# EAGLE design PMS (EAGLE 7.5.0)
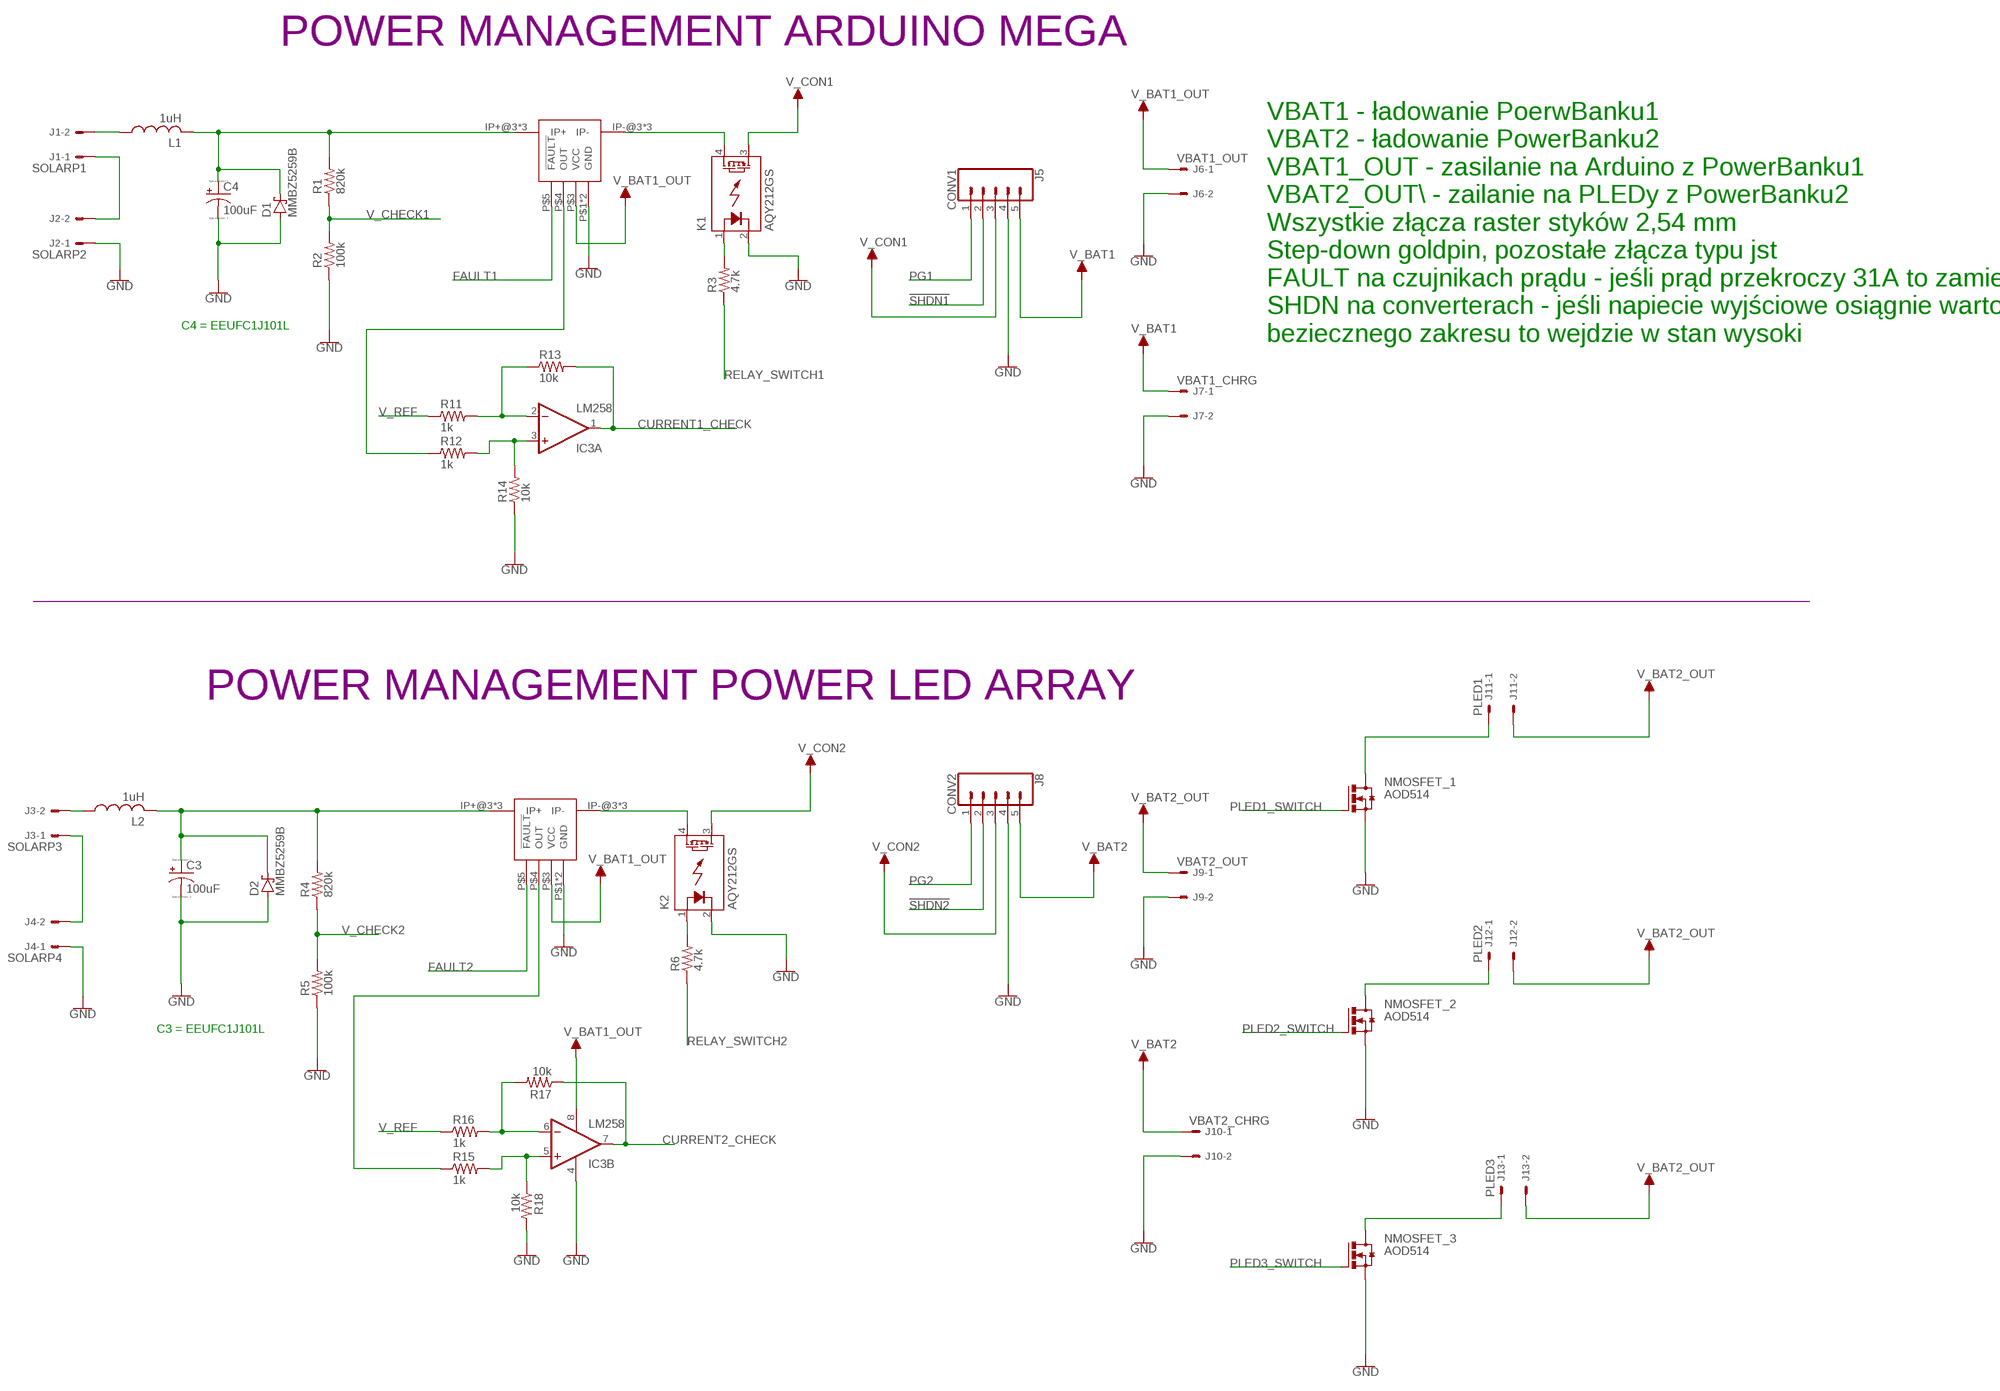
[diagram p0: schematic, sheet 1, part 1 of 2]
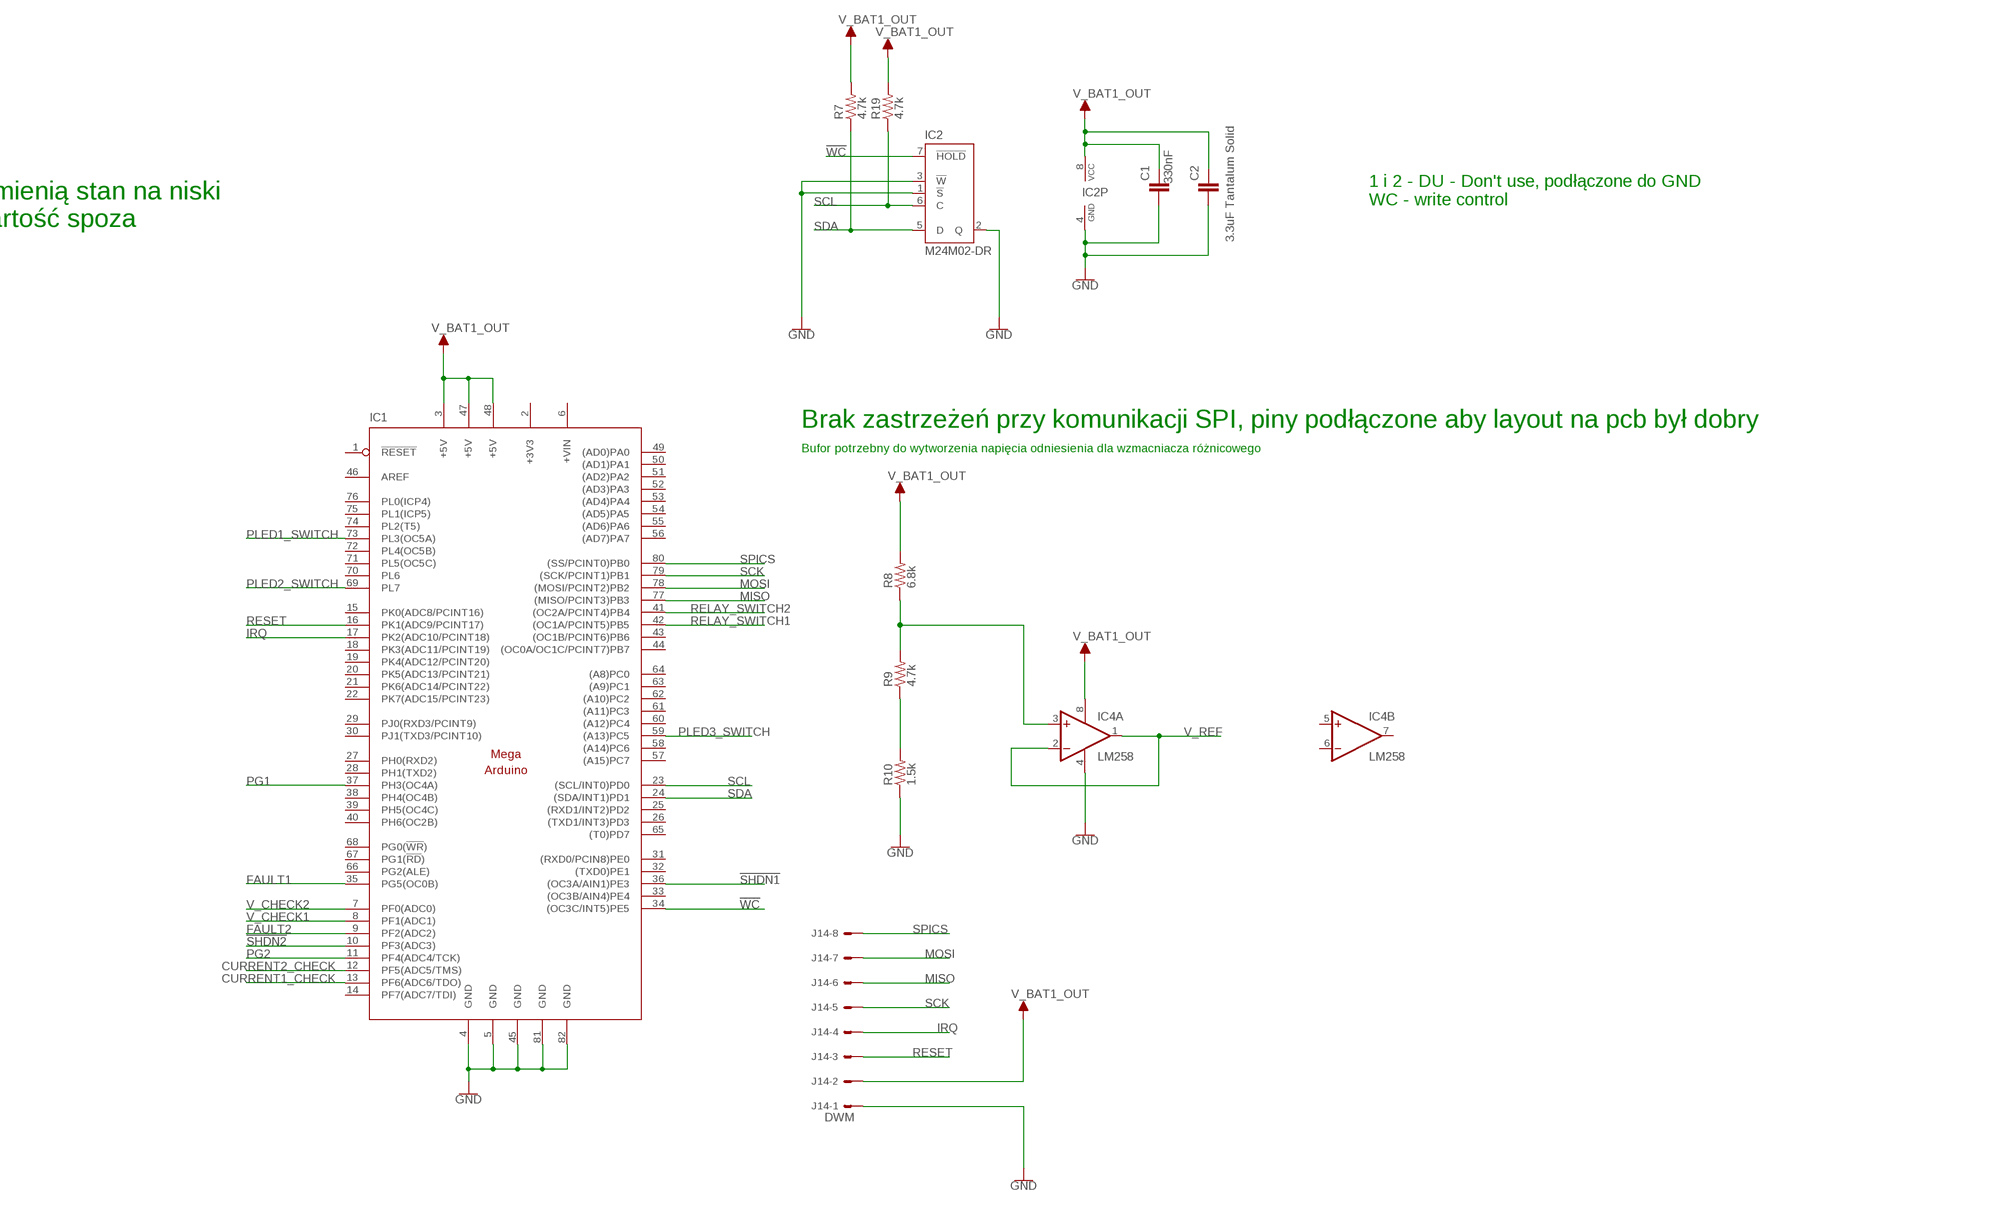
[diagram p1: schematic, sheet 1, part 2 of 2]

## Parts
C1  330nF  C-EUC0805  [C0805]
C2  3.3uF Tantalum Solid  C-EUC1206  [C1206]
C3  100uF  CPOL-USE3.5-8  [E3,5-8]
C4  100uF  CPOL-USE3.5-8  [E3,5-8]
CURRETN_SENS  ACS711EXSH  [POLOLU2453_SMALL_HOLES]
D1  MMBZ5259B  BAS40  [SOT23]
D2  MMBZ5259B  BAS40  [SOT23]
IC1  MEGAARDUINO_13  [MEGA_ARDUINO_3]
IC2  M24M02-DR  ST95P08M  [SO08]
IC3  LM258  LM358D  [SO08]
IC4  LM258  LM358D  [SO08]
J1  SOLARP1  22-27-2021-02  [6410-02]
J2  SOLARP2  22-27-2021-02  [6410-02]
J3  SOLARP3  22-27-2021-02  [6410-02]
J4  SOLARP4  22-27-2021-02  [6410-02]
J5  CONV1  CONN_05  [1X05]
J6  VBAT1_OUT  22-27-2021-02  [6410-02]
J7  VBAT1_CHRG  22-27-2021-02  [6410-02]
J8  CONV2  CONN_05  [1X05]
J9  VBAT2_OUT  22-27-2021-02  [6410-02]
J10  VBAT2_CHRG  22-27-2021-02  [6410-02]
J11  PLED1  22-27-2021-02  [6410-02]
J12  PLED2  22-27-2021-02  [6410-02]
J13  PLED3  22-27-2021-02  [6410-02]
J14  DWM  22-27-2081-08  [6410-08]
K1  AQY212GS  AQY21SOP  [SOP04]
K2  AQY212GS  AQY21SOP  [SOP04]
L1  1uH  L-USL3225M  [L3225M]
L2  1uH  L-USL3225M  [L3225M]
NMOSFET_1  AOD514  N_MOSFET_TO252  [TO252]
NMOSFET_2  AOD514  N_MOSFET_TO252  [TO252]
NMOSFET_3  AOD514  N_MOSFET_TO252  [TO252]
R1  820k  R-US_R0805  [R0805]
R2  100k  R-US_R0805  [R0805]
R3  4.7k  R-US_R0805  [R0805]
R4  820k  R-US_R0805  [R0805]
R5  100k  R-US_R0805  [R0805]
R6  4.7k  R-US_R0805  [R0805]
R7  4.7k  R-US_R0805  [R0805]
R8  6.8k  R-US_R0805  [R0805]
R9  4.7k  R-US_R0805  [R0805]
R10  1.5k  R-US_R0805  [R0805]
R11  1k  R-US_R0805  [R0805]
R12  1k  R-US_R0805  [R0805]
R13  10k  R-US_R0805  [R0805]
R14  10k  R-US_R0805  [R0805]
R15  1k  R-US_R0805  [R0805]
R16  1k  R-US_R0805  [R0805]
R17  10k  R-US_R0805  [R0805]
R18  10k  R-US_R0805  [R0805]
R19  4.7k  R-US_R0805  [R0805]
U$2  ACS711EXSH  [POLOLU2453_SMALL_HOLES]

## Nets
!SHDN1: IC1.36((OC3A/AIN1)PE3) J5.2
!SHDN2: IC1.10(PF3(ADC3)) J8.2
!WC: IC1.34((OC3C/INT5)PE5) IC2.7(!HOLD)
CURRENT1_CHECK: IC1.13(PF6(ADC6/TDO)) IC3.1(A:OUT) R13.2
CURRENT2_CHECK: IC1.12(PF5(ADC5/TMS)) IC3.7(B:OUT) R17.1
FAULT1: CURRETN_SENS.P$5(!FAULT) IC1.35(PG5(OC0B))
FAULT2: IC1.9(PF2(ADC2)) U$2.P$5(!FAULT)
GND: C1.1 C2.1 C3.- C4.- CURRETN_SENS.P$1(GND) CURRETN_SENS.P$2(GND) D1.1(A) D2.1(A) IC1.4(GND) IC1.5(GND) IC1.45(GND) IC1.81(GND) IC1.82(GND) IC2.1(!S) IC2.2(Q) IC2.3(!W) IC2.4(GND) IC3.4(P:V-) IC4.4(P:V-) J2.1 J4.1 J5.4 J6.2 J7.2 J8.4 J9.2 J10.2 J14.1 K1.2(K) K2.2(K) NMOSFET_1.3(S) NMOSFET_2.3(S) NMOSFET_3.3(S) R2.1 R5.1 R10.1 R14.1 R18.2 U$2.P$1(GND) U$2.P$2(GND)
IRQ: IC1.17(PK2(ADC10/PCINT18)) J14.4
MISO: IC1.77((MISO/PCINT3)PB3) J14.6
MOSI: IC1.78((MOSI/PCINT2)PB2) J14.7
N$1: K1.1(A) R3.2
N$3: CURRETN_SENS.IP-@3(IP-) CURRETN_SENS.IP-@4(IP-) CURRETN_SENS.IP-@5(IP-) K1.4(DS1)
N$4: J3.1 J4.2
N$5: J12.1 NMOSFET_2.4(D)
N$6: K2.1(A) R6.2
N$7: J13.1 NMOSFET_3.4(D)
N$8: IC3.2(A:-IN) R11.2 R13.1
N$9: J11.1 NMOSFET_1.4(D)
N$10: J1.1 J2.2
N$11: K2.4(DS1) U$2.IP-@3(IP-) U$2.IP-@4(IP-) U$2.IP-@5(IP-)
N$12: IC4.3(A:+IN) R8.1 R9.2
N$13: CURRETN_SENS.P$4(OUT) R12.1
N$14: IC3.6(B:-IN) R16.2 R17.2
N$15: IC3.5(B:+IN) R15.2 R18.1
N$16: IC3.3(A:+IN) R12.2 R14.2
N$17: R15.1 U$2.P$4(OUT)
N$18: R9.1 R10.2
N$19: C3.+ D2.3(C) L2.2 R4.2 U$2.IP+@3(IP+) U$2.IP+@4(IP+) U$2.IP+@5(IP+)
N$20: C4.+ CURRETN_SENS.IP+@3(IP+) CURRETN_SENS.IP+@4(IP+) CURRETN_SENS.IP+@5(IP+) D1.3(C) L1.2 R1.2
N$22: J1.2 L1.1
N$23: J3.2 L2.1
PG1: IC1.37(PH3(OC4A)) J5.1
PG2: IC1.11(PF4(ADC4/TCK)) J8.1
PLED1_SWITCH: IC1.73(PL3(OC5A)) NMOSFET_1.1(G)
PLED2_SWITCH: IC1.69(PL7) NMOSFET_2.1(G)
PLED3_SWITCH: IC1.59((A13)PC5) NMOSFET_3.1(G)
RELAY_SWITCH1: IC1.42((OC1A/PCINT5)PB5) R3.1
RELAY_SWITCH2: IC1.41((OC2A/PCINT4)PB4) R6.1
RESET: IC1.16(PK1(ADC9/PCINT17)) J14.3
SCK: IC1.79((SCK/PCINT1)PB1) J14.5
SCL: IC1.23((SCL/INT0)PD0) IC2.6(C) R19.1
SDA: IC1.24((SDA/INT1)PD1) IC2.5(D) R7.1
SPICS: IC1.80((SS/PCINT0)PB0) J14.8
V2: J5.3 K1.3(DS2) ; supply symbol labelled V_CON1
V4: J8.3 K2.3(DS2) ; supply symbol labelled V_CON2
V_BAT1: J5.5 J7.1
V_BAT1_OUT: C1.2 C2.2 CURRETN_SENS.P$3(VCC) IC1.3(+5V) IC1.47(+5V) IC1.48(+5V) IC2.8(VCC) IC3.8(P:V+) IC4.8(P:V+) J6.1 J14.2 R7.2 R8.2 R19.2 U$2.P$3(VCC)
V_BAT2: J8.5 J10.1
V_BAT4: J9.1 J11.2 J12.2 J13.2 ; supply symbol labelled V_BAT2_OUT
V_CHECK1: IC1.8(PF1(ADC1)) R1.1 R2.2
V_CHECK2: IC1.7(PF0(ADC0)) R4.1 R5.2
V_REF: IC4.1(A:OUT) IC4.2(A:-IN) R11.1 R16.1
Unconnected: IC1.1(!RESET) IC1.14(PF7(ADC7/TDI)) IC1.15(PK0(ADC8/PCINT16)) IC1.18(PK3(ADC11/PCINT19)) IC1.19(PK4(ADC12/PCINT20)) IC1.20(PK5(ADC13/PCINT21)) IC1.21(PK6(ADC14/PCINT22)) IC1.22(PK7(ADC15/PCINT23)) IC1.25((RXD1/INT2)PD2) IC1.26((TXD1/INT3)PD3) IC1.27(PH0(RXD2)) IC1.28(PH1(TXD2)) IC1.29(PJ0(RXD3/PCINT9)) IC1.30(PJ1(TXD3/PCINT10)) IC1.31((RXD0/PCIN8)PE0) IC1.32((TXD0)PE1) IC1.33((OC3B/AIN4)PE4) IC1.38(PH4(OC4B)) IC1.39(PH5(OC4C)) IC1.40(PH6(OC2B)) IC1.43((OC1B/PCINT6)PB6) IC1.44((OC0A/OC1C/PCINT7)PB7) IC1.46(AREF) IC1.49((AD0)PA0) IC1.50((AD1)PA1) IC1.51((AD2)PA2) IC1.52((AD3)PA3) IC1.53((AD4)PA4) IC1.54((AD5)PA5) IC1.55((AD6)PA6) IC1.56((AD7)PA7) IC1.57((A15)PC7) IC1.58((A14)PC6) IC1.60((A12)PC4) IC1.61((A11)PC3) IC1.62((A10)PC2) IC1.63((A9)PC1) IC1.64((A8)PC0) IC1.65((T0)PD7) IC1.66(PG2(ALE)) IC1.67(PG1(!RD!)) IC1.68(PG0(!WR!)) IC1.70(PL6) IC1.71(PL5(OC5C)) IC1.72(PL4(OC5B)) IC1.74(PL2(T5)) IC1.75(PL1(ICP5)) IC1.76(PL0(ICP4)) IC4.5(B:+IN) IC4.6(B:-IN) IC4.7(B:OUT)

## Notes on the sheet
- POWER MANAGEMENT ARDUINO MEGA
- 1 i 2 - DU - Don't use, podłączone do GND
  WC - write control
- C4 = EEUFC1J101L
- VBAT1 - ładowanie PoerwBanku1
  VBAT2 - ładowanie PowerBanku2
  VBAT1_OUT - zasilanie na Arduino z PowerBanku1
  VBAT2_OUT\ - zailanie na PLEDy z PowerBanku2
  Wszystkie złącza raster styków 2,54 mm
  Step-down goldpin, pozostałe złącza typu jst
  FAULT na czujnikach prądu - jeśli prąd przekroczy 31A to zamienią stan na niski 
  SHDN na converterach - jeśli napiecie wyjściowe osiągnie wartość spoza
  beziecznego zakresu to wejdzie w stan wysoki
- Brak zastrzeżeń przy komunikacji SPI, piny podłączone aby layout na pcb był dobry
- Bufor potrzebny do wytworzenia napięcia odniesienia dla wzmacniacza różnicowego
- POWER MANAGEMENT POWER LED ARRAY
- C3 = EEUFC1J101L

## Power pins joined to a net without a drawn wire
+3V3: IC1.2(+3V3)
+VIN: IC1.6(+VIN)

## Library data of the parts
C1 C2 = rcl:C-EU: CAPACITOR, European symbol; SPICEPREFIX: C
C3 C4 = resistor:CPOL-US: POLARIZED CAPACITOR, American symbol
CURRETN_SENS U$2 = POLOLU2453:ACS711EX
D1 D2 = diode:BAS40: Silicon Schottky Diodes General-purpose diode for high-speed switching
IC1 = arduino:MEGAARDUINO_1: The Arduino Mega is a microcontroller board based on the ATmega1280. - 54 digital input/output pins (of which 14 can be used as PWM outputs) - 16 analog inputs - 4 UARTs (hardware serial ports) - 16 MHz crystal oscillator - USB connection - power jack - ICSP header - reset button It contains everything needed to support the microcontroller; simply connect it to a computer with a USB cable or power it with a AC-to-DC adapter or battery to get started. The Mega is compatible with most shields designed for the Arduino Duemilanove or Diecimila. http://arduino.cc/en/Main/ArduinoBoardMega
IC2 = st-microelectronics:ST95P08M: Serial EEPROM SPI bus, 1 K x 8; OC_FARNELL: unknown; OC_NEWARK: unknown
IC3 IC4 = linear:LM358: OP AMP also LM158; LM258; LM2904 Source: http://cache.national.com/ds/LM/LM158.pdf
J1-J4 J6 J7 J9-J13 = EP_molex_6410_7395:22-?-02: CONNECTOR wire to board 2.54 mm (.1 inch) pitch header
J5 J8 = SparkFun-Connectors:CONN_05: Multi connection point. Often used as Generic Header-pin footprint for 0.1 inch spaced/style header connections On any of the 0.1 inch spaced packages, you can populate with these: Break Away Headers - Straight <https://www.sparkfun.com/products/116> (PRT-00116) Break Away Male Headers - Right Angle <https://www.sparkfun.com/products/553> (PRT-00553) Female Headers <https://www.sparkfun.com/products/115> (PRT-00115) Break Away Headers - Machine Pin <https://www.sparkfun.com/products/117> (PRT-00117) Break Away Female Headers - Swiss Machine Pin <https://www.sparkfun.com/products/743> (PRT-00743) For SCREWTERMINALS and SPRING TERMINALS visit here: Screw Terimnals on SparkFun.com <https://www.sparkfun.com/search/results?term=Screw+Terminals> (5mm/3.5mm/2.54mm spacing) This device is also useful as a general connection point to wire up your design to another part of your project. Our various solder wires solder well into these plated through hole pads. Hook-Up Wire - Assortment (Stranded, 22 AWG) <https://www.sparkfun.com/products/11375> (PRT-11375) Hook-Up Wire - Assortment (Solid Core, 22 AWG) <https://www.sparkfun.com/products/11367> (PRT-11367) View the entire wire category on our website here <https://www.sparkfun.com/categories/141> Special notes: Molex polarized connector foot print use with SKU : PRT-08231 with associated crimp pins and housings. 1MM SMD Version SKU: PRT-10208
J14 = EP_molex_6410_7395:22-?-08: CONNECTOR wire to board 2.54 mm (.1 inch) pitch header
K1 K2 = relay:AQY*: PhotoMOS Relay NAiS Source: http://www.panasonic-electric-works.com/catalogues/downloads/photomos/ds_x615_en_aqz10_20.pdf; OC_FARNELL: unknown; OC_NEWARK: unknown
L1 L2 = resistor:L-US: INDUCTOR, American symbol
NMOSFET_1-NMOSFET_3 = power-mosfet:N_MOSFET_TO252
R1-R19 = rcl:R-US_: RESISTOR, American symbol; SPICEPREFIX: R

## Board
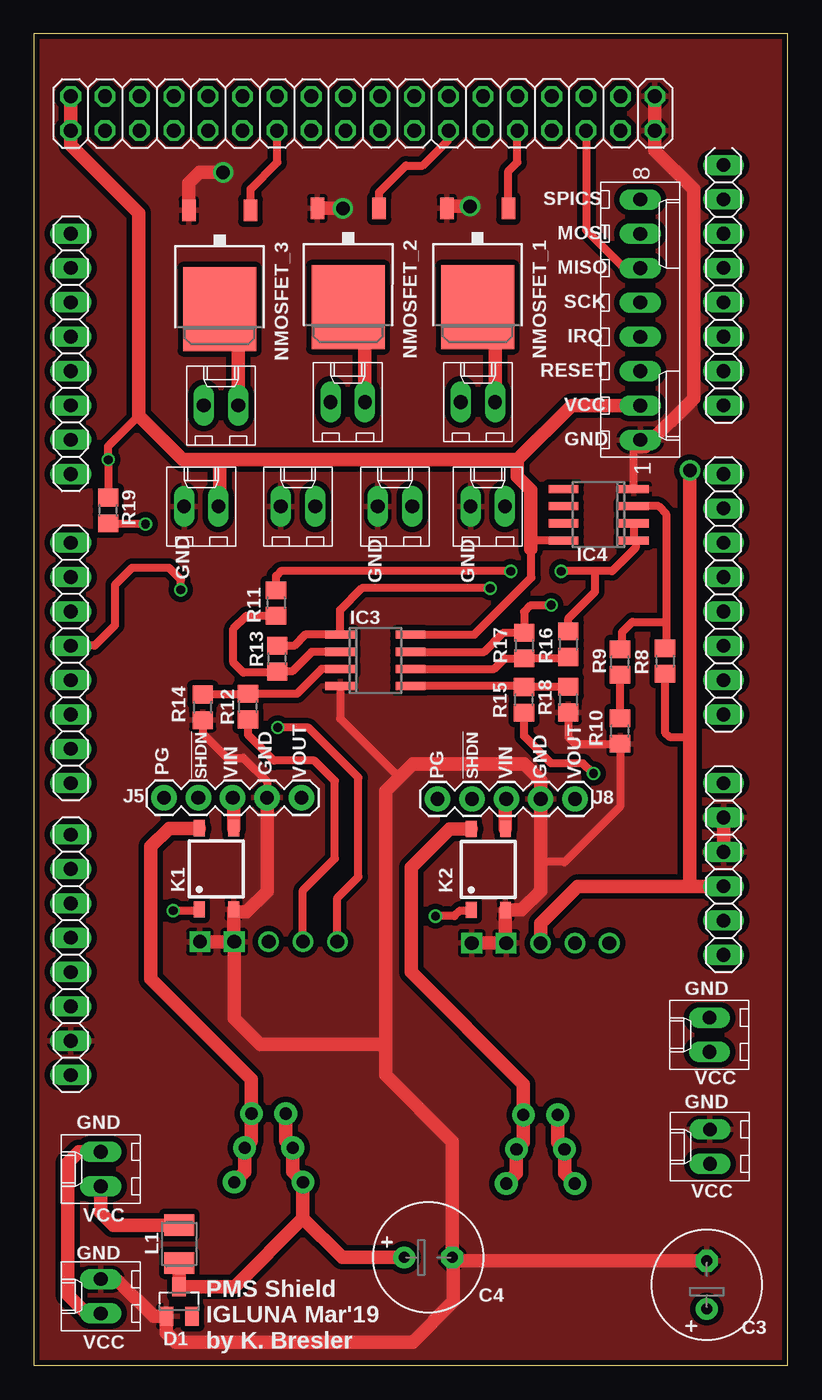
[diagram p2: board, top side]
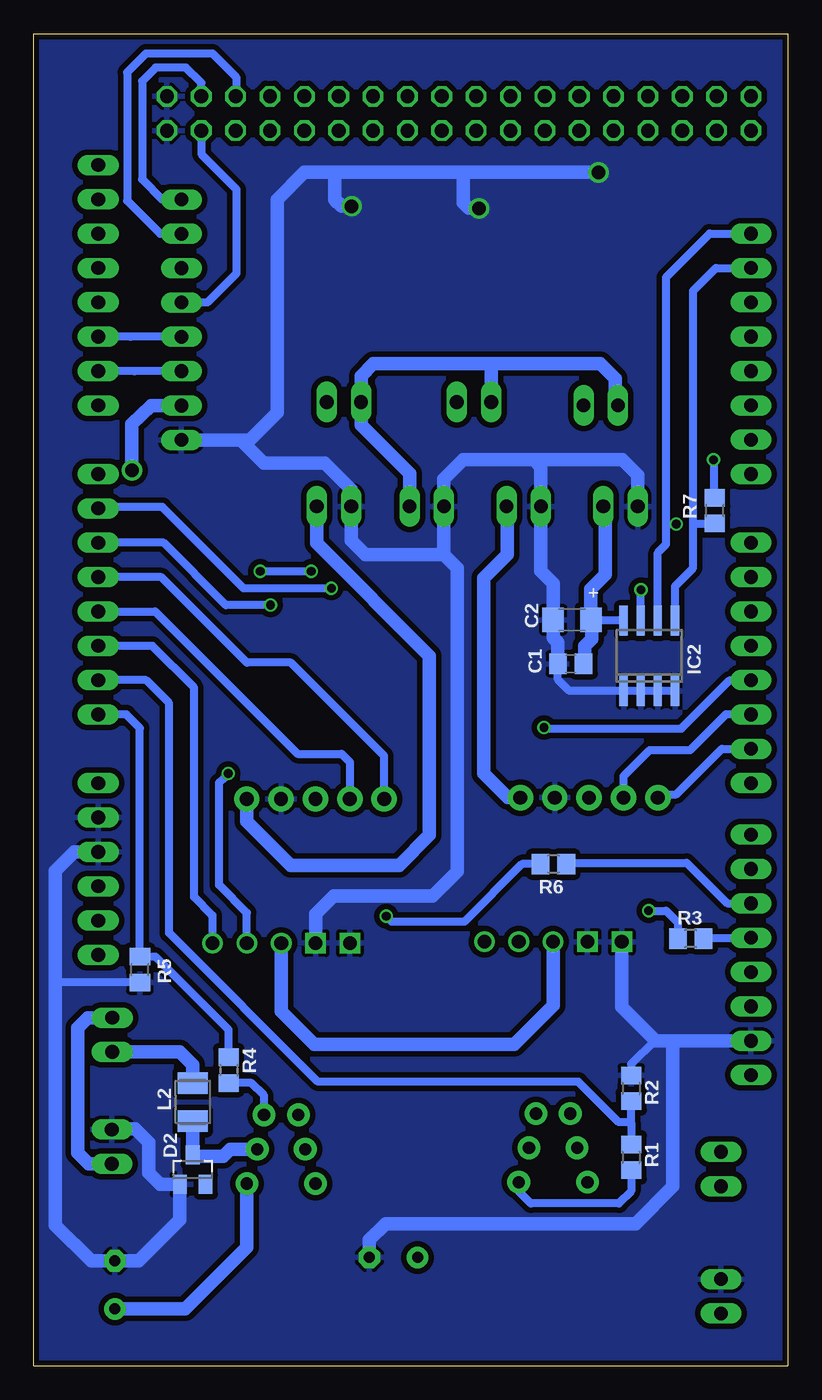
[diagram p3: board, bottom side, seen from below]

Size 55.75 x 98.5 mm. Coordinates in mm from the lower left corner, seen from the top.
Outline: 55.75,0 55.75,98.5 0,98.5 0,0 55.75,0
Copper layers (1*16): Top 0.035mm / dielectric 1.5mm / Bottom 0.035mm
Design rules "jlcpcb_rules": minimum track width 5mil, minimum drill 0.2mm, track to track 5mil, track to pad 5mil, pad to pad 5mil, via to via 5mil, smd to smd 5mil, copper to edge 0.2mm, drill to drill 12mil, minimum pad ring 3mil, minimum via ring 3mil, stop-mask expansion 4mil, vias tented up to drill 0mil, thermal gap 10mil

### Footprints (pad centres in the part's own frame; a part is rotated, then mirrored left to right if it is on the bottom)
C0805 = smd 1.3 x 1.5: 1 -0.95,0; 2 0.95,0
C1206 = smd 1.6 x 1.8: 1 -1.4,0; 2 1.4,0
E3,5-8 = drill 0.813 pad 1.6: + -1.778,0 | drill 0.813 pad 1.6 octagon: - 1.778,0
POLOLU2453_SMALL_HOLES = drill 0.9 pad 1.676: IP+@3 6.35,19.05; IP+@4 7.112,16.51; IP+@5 7.62,13.97; IP-@3 11.43,19.05; IP-@4 10.668,16.51; IP-@5 10.16,13.97 | drill 1.016 square: P$1 13.97,1.27; P$2 11.43,1.27 | drill 1.016: P$3 8.89,1.27; P$4 6.35,1.27; P$5 3.81,1.27
SOT23 = smd 1 x 1.4: 1 -0.95,-1.1; 2 0.95,-1.1; 3 0,1.1
MEGA_ARDUINO_3 = drill 1.016 long: 1 33.02,2.54; 2 35.56,2.54; 3 38.1,2.54; 4 40.64,2.54; 5 43.18,2.54; 6 45.72,2.54; 7 50.8,2.54; 8 53.34,2.54; 9 55.88,2.54; 10 58.42,2.54; 11 60.96,2.54; 12 63.5,2.54; 13 66.04,2.54; 14 68.58,2.54; 15 73.66,2.54; 16 76.2,2.54; 17 78.74,2.54; 18 81.28,2.54; 19 83.82,2.54; 20 86.36,2.54; 21 88.9,2.54; 22 91.44,2.54; 23 86.36,50.8; 24 83.82,50.8; 25 81.28,50.8; 26 78.74,50.8; 27 76.2,50.8; 28 73.66,50.8; 29 71.12,50.8; 30 68.58,50.8; 31 63.5,50.8; 32 60.96,50.8; 33 58.42,50.8; 34 55.88,50.8; 35 53.34,50.8; 36 50.8,50.8; 37 48.26,50.8; 38 45.72,50.8; 39 41.91,50.8; 40 39.37,50.8; 41 36.83,50.8; 42 34.29,50.8; 43 31.75,50.8; 44 29.21,50.8; 45 26.67,50.8; 46 24.13,50.8 | drill 1.016 octagon: 47 93.98,50.8; 48 96.52,50.8; 49 93.98,48.26; 50 96.52,48.26; 51 93.98,45.72; 52 96.52,45.72; 53 93.98,43.18; 54 96.52,43.18; 55 93.98,40.64; 56 96.52,40.64; 57 93.98,38.1; 58 96.52,38.1; 59 93.98,35.56; 60 96.52,35.56; 61 93.98,33.02; 62 96.52,33.02; 63 93.98,30.48; 64 96.52,30.48; 65 93.98,27.94; 66 96.52,27.94; 67 93.98,25.4; 68 96.52,25.4; 69 93.98,22.86; 70 96.52,22.86; 71 93.98,20.32; 72 96.52,20.32; 73 93.98,17.78; 74 96.52,17.78; 75 93.98,15.24; 76 96.52,15.24; 77 93.98,12.7; 78 96.52,12.7; 79 93.98,10.16; 80 96.52,10.16; 81 93.98,7.62; 82 96.52,7.62
SO08 = smd 0.6 x 2.2: 1 -1.905,-2.6; 2 -0.635,-2.6; 3 0.635,-2.6; 4 1.905,-2.6; 5 1.905,2.6; 6 0.635,2.6; 7 -0.635,2.6; 8 -1.905,2.6
6410-02 = drill 1.016 long: 1 1.27,0; 2 -1.27,0
1X05 = drill 1.016 pad 1.88: 1 0,0; 2 2.54,0; 3 5.08,0; 4 7.62,0; 5 10.16,0
6410-08 = drill 1.016 long: 1 8.89,0; 2 6.35,0; 3 3.81,0; 4 1.27,0; 5 -1.27,0; 6 -3.81,0; 7 -6.35,0; 8 -8.89,0
SOP04 = smd 0.8 x 1.2: 1 -1.27,-3; 2 1.27,-3; 3 1.27,3; 4 -1.27,3
L3225M = smd 1.6 x 2.2: 1 -1.4,0; 2 1.4,0
TO252 = smd 1 x 1.6: 1 -2.28,-4.8; 3 2.28,-4.8 | smd 5.4 x 6.2: 4 0,2.5
R0805 = smd 1.3 x 1.5: 1 -0.95,0; 2 0.95,0

### Placement (x,y rotation side)
C1  16.06,51.91 0 bottom
C2  15.96,55.16 0 bottom
C3  49.75,5.98 90 top
C4  29.16,8 0 top
CURRETN_SENS  26.25,32.62 180 top
D1  10.75,4.75 0 top
D2  44,14.5 0 bottom
IC1  53.53,-2.64 90 top
IC2  10.25,52.5 0 bottom
IC3  25.25,52.16 270 top
IC4  41.75,62.93 90 top
J1  4.95,14.54 90 top
J2  4.95,5.13 90 top
J3  49.95,24.47 90 top
J4  49.98,16.2 90 top
J5  9.62,42.01 0 top
J6  12.38,63.55 0 top
J7  19.53,63.55 0 top
J8  29.85,41.91 0 top
J9  26.7,63.55 0 top
J10  33.56,63.55 0 top
J11  32.83,71.27 0 top
J12  23.21,71.27 0 top
J13  13.84,71.02 0 top
J14  44.83,77.36 270 top
K1  13.5,36.75 0 top
K2  33.6,36.7 0 top
L1  10.75,9 270 top
L2  44,19.5 270 bottom
NMOSFET_1  32.81,80.79 180 top
NMOSFET_2  23.24,80.79 180 top
NMOSFET_3  13.74,80.64 180 top
R1  11.59,15.41 270 bottom
R2  11.59,20.51 270 bottom
R3  7.19,31.59 180 bottom
R4  41.34,21.86 270 bottom
R5  47.91,29.29 90 bottom
R6  17.34,37.09 180 bottom
R7  5.41,63.24 90 bottom
R8  46.66,52.11 270 top
R9  43.34,52.04 90 top
R10  43.34,46.94 90 top
R11  17.91,56.41 270 top
R12  15.84,48.74 90 top
R13  17.99,52.29 90 top
R14  12.49,48.69 90 top
R15  36.24,49.24 90 top
R16  39.51,53.36 270 top
R17  36.26,53.26 270 top
R18  39.51,49.26 270 top
R19  5.5,63.25 90 top
U$2  46.35,32.52 180 top

### Tracks (layer width: path | path; a pad name or v marks a point on that pad's centre or on a via)
!SHDN1
  Bottom 0.61: IC1.36 4.59,48.16 7.25,45.5 10.25,45.5 12.16,43.59 J5.2
!SHDN2
  Bottom 0.61: IC1.10 46.78,55.78 36.25,45.25 33,45.25 32.39,44.64 J8.2
!WC  (via drill 0.65)
  Top 0.61: v10.86,57.39 10.87,58.13 10,59 7.25,59 6,57.75 6,54.75 4.5,53.25 IC1.34
  Bottom 0.61: IC2.7 v10.86,57.39
CURRENT1_CHECK  (via drill 0.65)
  Top 0.61: v33.75,57.5 24.25,57.5 22.65,55.9 IC3.1 20.06,54.06 19.24,53.24 R13.2
  Bottom 0.61: IC1.13 50.89,63.5 46.25,63.5 40.25,57.5 v33.75,57.5
CURRENT2_CHECK  (via drill 0.65)
  Top 0.61: v38.25,56.25 36.75,56.25 36.25,55.75 R17.1 34.71,54.21 33.3,52.8 IC3.7
  Bottom 0.61: v38.25,56.25 41.54,56.25 46.15,60.86 IC1.12
FAULT1  (via drill 0.65)
  Top 0.61: CURRETN_SENS.P$5 22.44,34.6 24,36.16 24,43.5 20.3,47.2 v18.04,47.2
  Bottom 0.61: IC1.35 4.3,50.7 7.88,47.12 17.96,47.12 v18.04,47.2
FAULT2
  Bottom 0.61: IC1.9 46.99,53.24 43.9,50.15 43.9,34.65 42.55,33.3 42.55,33.16 42.54,33.15 U$2.P$5
GND  (via drill 1)
  Top 0.61: IC4.4 44.35,67.81 44.5,67.96 45.01,68.47 | IC3.4 22.65,47.85 27,43.5 | 37.47,37.25 39.25,37.25 43.34,41.34 R10.1 40.01,45.99 39.51,46.49 R18.2 | R14.1 12.5,46.75 14.3,44.95 15.5,44.95 17.24,43.21 J5.4
  Top 1.016: NMOSFET_3.3 11.46,87.46 12.25,88.25 v14,88.25 | NMOSFET_2.3 v22.84,85.59 | NMOSFET_1.3 30.69,85.75 v32.25,85.75 | IC1.82 IC1.81 45.91,89.87 48.79,87 48.79,71.54 45.21,67.96 44.5,67.96 | IC1.5 IC1.4 | U$2.P$1 U$2.P$2 34.87,31.3 K2.2 36.05,33.7 37.47,35.12 37.47,37.25 J8.4 37.47,43.28 36.25,44.5 28,44.5 27,43.5 26,42.5 26,23.75 | CURRETN_SENS.P$1 CURRETN_SENS.P$2 | 26,23.75 16.75,23.75 14.82,25.68 CURRETN_SENS.P$2 | 45.01,68.47 J14.1 | J2.1 5.1,6.25 6.25,6.25 8.85,3.65 D1.1 9.8,2.45 10.5,1.75 28,1.75 31,4.75 31,7.94 C4.- | C4.- 30.94,16.56 26,21.5 26,23.75 | C3.- 31.18,7.76 C4.- | CURRETN_SENS.P$2 14.77,31.4 K1.2 14.97,33.55 15.7,33.55 17.24,35.09 J5.4
  Bottom 0.61: IC2.4 IC2.3 IC2.2 IC2.1 16.15,49.9 17.01,50.76 C1.1 | 9.86,24.03 11.59,22.3 R2.1 | R5.1 54.06,28.34 54.15,28.25
  Bottom 1.016: v14,88.25 24,88.25 | 24,88.25 33.75,88.25 | 33.75,88.25 35.75,88.25 37.75,86.25 37.75,70.5 39.78,68.47 J14.1 40.47,68.47 38.75,66.75 34.25,66.75 32.29,64.79 J10.2 32.29,61.04 31.25,60 25.43,60 | v32.25,85.75 33,85.75 33.5,86.25 33.5,88 33.75,88.25 | v22.84,85.59 23.59,85.59 24,86 24,88.25 | IC1.45 8.75,24.03 | 8.75,24.03 9.78,24.03 | 9.78,24.03 9.86,24.03 | CURRETN_SENS.P$1 12.28,26.53 9.78,24.03 | 18.75,67 12.25,67 11.11,65.86 J6.2 | 18.75,67 18.26,66.51 J7.2 18.26,58.76 17.36,57.86 C2.1 17.36,53.86 17,53.5 C1.1 | 18.75,67 24,67 25.43,65.57 J9.2 25.43,60 | U$2.P$2 34.92,33.41 33.58,34.75 26.25,34.75 24.43,36.57 24.43,59 25.43,60 | IC1.4 52.75,38 54.15,36.6 54.15,28.25 54.15,10.4 51.5,7.75 51.49,7.76 C3.- 47.99,7.76 44.95,10.8 D2.1 46.4,13.4 47.25,14.25 47.25,16.5 48.25,17.5 49.95,17.5 J4.1 | C4.- 30.94,9.31 29.75,10.5 11.25,10.5 8.5,13.25 8.5,23.78 8.75,24.03
  pour Top (isolate 0.406): 0,98.5 55.75,98.5 55.75,0 0,0
  pour Bottom (isolate 0.406): 0,98.5 55.75,98.5 55.75,0 0,0
IRQ
  Bottom 0.61: J14.4 48.59,76.09 48.6,76.1 IC1.17
MISO
  Top 0.61: IC1.77 40.83,83.98 43.65,81.17 J14.6
MOSI
  Bottom 0.61: IC1.78 40.75,93.96 40.75,95.25 42.53,97.03 47.47,97.03 48.86,95.64 48.86,86.15 46.42,83.71 J14.7
N$1  (via drill 0.65)
  Top 0.61: K1.1 12.13,33.65 v10.3,33.65
  Bottom 0.61: v10.3,33.65 9,33.65 8.14,32.79 R3.2
N$3
  Top 1.016: CURRETN_SENS.IP-@3 15.58,14.33 CURRETN_SENS.IP-@4 16.09,16.62 CURRETN_SENS.IP-@5 16.09,21.16 8.63,28.62 8.63,38.38 10,39.75 K1.4
N$4
  Bottom 1.016: J4.2 51.68,14.93 52.5,15.75 52.5,25 51.76,25.74 J3.1
N$5
  Top 1.016: J12.1 24.48,77.05 NMOSFET_2.4
N$6  (via drill 0.65)
  Top 0.61: K2.1 32.28,33.65 31.5,33.65 31.1,33.25 v29.7,33.25
  Bottom 0.61: v29.7,33.25 29.3,32.85 23.9,32.85 19.66,37.09 R6.2
N$7
  Top 1.016: J13.1 15.11,76.77 NMOSFET_3.4
N$8
  Top 0.61: R11.2 15.71,55.46 14.75,54.5 14.75,52 15.5,51.25 17.9,51.25 R13.1 19.09,51.34 20.55,52.8 IC3.2
N$9
  Top 1.016: J11.1 34.1,77 NMOSFET_1.4
N$10
  Top 1.016: J1.1 3.31,15.81 2.5,15 2.5,5.25 3.89,3.86 J2.2
N$11
  Top 1.016: U$2.IP-@3 35.68,14.23 U$2.IP-@4 36.19,16.52 U$2.IP-@5 36.19,20.81 27.88,29.12 27.88,36.84 30.75,39.7 K2.4
N$12
  Top 0.61: IC4.3 46.19,63.56 46.75,63 46.75,55 | R9.2 43.5,53.15 43.5,54.25 44.25,55 46.75,55 | R8.1 46.75,53.15 46.75,55
N$13
  Top 0.61: CURRETN_SENS.P$4 19.9,35.15 22.25,37.5 22.25,43.25 20.75,44.75 17.75,44.75 15.84,46.66 R12.1
N$14
  Top 0.61: R16.2 39.41,52.31 R17.2 34.81,52.31 34.02,51.53 IC3.6
N$15
  Top 0.61: R18.1 39.49,50.19 R15.2 36.18,50.25 IC3.5
N$16
  Top 0.61: R14.2 15.79,49.64 R12.2 19.44,49.69 21.27,51.53 IC3.3
N$17  (via drill 0.65)
  Top 0.61: v41.37,43.79 41.34,43.79 40.59,44.54 38.25,44.55 36.24,46.56 R15.1
  Bottom 0.61: U$2.P$4 40,33.5 42.05,35.55 42.05,43.12 41.72,43.41 v41.37,43.79
N$18
  Top 0.61: R10.2 R9.1
N$19
  Top 1.016: U$2.IP+@3 39.24,14.23 U$2.IP+@4 38.73,16.52 U$2.IP+@5
  Bottom 0.61: U$2.IP+@5 38.73,19.98 39.66,20.91 R4.2
  Bottom 1.016: C3.+ 44.55,4.2 40,8.75 U$2.IP+@3 | L2.2 D2.3 43.9,15.5 41.75,15.5 41.24,16.01 U$2.IP+@4
N$20
  Top 1.016: CURRETN_SENS.IP+@5 18.63,16.62 CURRETN_SENS.IP+@4 19.14,14.33 CURRETN_SENS.IP+@3 19.9,10.9 | 19.9,10.9 14.85,5.85 D1.3 L1.2 | 19.9,10.9 22.8,8 C4.+
  Bottom 0.61: R1.2 11.59,12.91 12.5,12 19,12 19.9,12.9 CURRETN_SENS.IP+@3
N$22
  Top 1.016: J1.2 4.95,11.3 5.87,10.38 L1.1
N$23
  Bottom 1.016: J3.2 44.95,23.2 44,22.25 L2.1
PG1
  Bottom 0.61: J5.1 9.38,42.25 8.25,42.25 4.88,45.62 IC1.37
PG2
  Bottom 0.61: IC1.11 46.32,58.32 40,52 36.75,52 29.85,45.1 J8.1
PLED1_SWITCH
  Top 0.61: NMOSFET_1.1 35.09,88.34 35.75,89 IC1.73
PLED2_SWITCH
  Top 0.61: NMOSFET_2.1 25.52,86.77 27.5,88.75 28.75,88.75 30.67,90.67 IC1.69
PLED3_SWITCH
  Top 0.61: NMOSFET_3.1 16.02,87.02 18,89 18,91.31 IC1.59
RELAY_SWITCH1
  Bottom 0.61: R3.1 6.18,31.65 IC1.42
RELAY_SWITCH2
  Bottom 0.61: R6.1 16.29,37.19 7.48,37.19 4.48,34.19 IC1.41
RESET
  Bottom 0.61: J14.3 48.3,73.55 48.31,73.56 IC1.16
SCK
  Bottom 0.61: IC1.79 43.37,89.61 40.77,87.01 40.77,80.78 42.92,78.63 J14.5
SCL  (via drill 0.65)
  Top 0.61: v8.25,62.25 5.55,62.25 R19.1
  Bottom 0.61: IC1.23 5.78,83.72 9,80.5 9,62.25 | IC2.6 9.61,60.14 9,60.75 9,62.25 | 9,62.25 v8.25,62.25
SDA
  Bottom 0.61: IC1.24 5.32,81.18 7,79.5 7,62.25 | IC2.5 8.34,57.66 7,59 7,62.25 | R7.1 5.45,62.25 7,62.25
SPICS
  Bottom 0.61: IC1.80 43.37,94.87 44.5,96 46.75,96 47.75,95 47.75,87.73 46.27,86.25 J14.8
V2
  Top 1.016: J5.3 14.77,41.94 K1.3
V4
  Top 1.016: J8.3 34.87,41.84 K2.3
V_BAT1
  Bottom 1.016: J5.5 20.71,42.01 22.5,43.8 22.5,58.25 20.75,60 20.75,63.5 J7.1
V_BAT1_OUT  (via drill 0.65, 1)
  Top 0.61: 7.75,70.25 5.5,68 v5.5,67 R19.2 | R8.2 46.66,46.84 47,46.5 48.5,46.5 | IC3.8 32.56,54.06 36.77,58.28 36.77,60.38 36.75,60.4 | IC4.8 36.77,61.03 36.75,61.05
  Top 1.016: 48.25,35.46 40.21,35.46 37.46,32.71 U$2.P$3 | 48.25,35.46 IC1.3 | IC1.48 IC1.47 2.73,90.27 7.75,85.25 7.75,70.25 11,67 13.75,67 | J14.2 39.76,71.01 35.75,67 | 35.75,67 13.75,67 | 13.75,67 13.75,63.65 J6.1 | 35.75,67 35.75,65.75 36.75,64.75 36.75,61.05 36.75,60.4 | v48.5,66.21 48.5,46.5 48.5,35.71 48.25,35.46
  Bottom 0.61: IC2.8 14.5,55.1 | v5.5,67 5.5,64.28 R7.2
  Bottom 1.016: U$2.P$3 37.46,26.21 35,23.75 20.25,23.75 17.36,26.64 CURRETN_SENS.P$3 | C1.2 15.01,52.01 15.01,53.24 14.5,53.75 14.5,55.1 C2.2 14.56,57.44 13.5,58.5 13.5,63.4 J6.1 | J14.2 47.07,71.01 48.5,69.62 v48.5,66.21
V_BAT2
  Bottom 1.016: J10.1 34.83,60.83 26.5,52.5 26.5,39.25 28.75,37 36.75,37 40.01,40.26 J8.5
V_BAT4
  Bottom 1.016: J13.2 12.75,71.2 12.75,73 13.86,74.11 21.94,74.11 | 21.94,74.11 30.64,74.11 31.56,73.19 J11.2 31.56,69.56 27.97,65.97 J9.1 | J12.2 21.94,74.11
V_CHECK1
  Bottom 0.61: 11.59,18 R1.1 | 11.59,18 R2.2 | 11.59,18 12.5,18 15.5,21 34.75,21 45.75,32 45.75,49 47.45,50.7 IC1.8
V_CHECK2
  Bottom 0.61: IC1.7 48.91,48.16 48.12,47.38 47.91,47.16 R5.2 46.74,30.24 41.34,24.84 R4.1
V_REF  (via drill 0.65)
  Top 0.61: IC4.2 IC4.1 44.5,60.88 44.5,60.5 42.75,58.75 41.5,58.75 | R11.1 17.91,58.41 18.25,58.75 v35.25,58.75 | 41.5,58.75 v39,58.75 | R16.1 39.51,55.26 41.5,57.25 41.5,58.75
  Bottom 0.61: v39,58.75 v35.25,58.75

### Text on the board
tNames: SPICS | MOSI | MISO | SCK | IRQ | RESET | VCC | GND | GND | GND | GND | PG | !SHDN | VIN | GND | VOUT | PG | !SHDN | VIN | GND | VOUT | . | . | GND | VCC | GND | GND | VCC | VCC | GND | + | + | VCC | PMS Shield / IGLUNA Mar'19 / by K. Bresler
bNames: +